# EAGLE design 230_color (EAGLE 9.6.2)
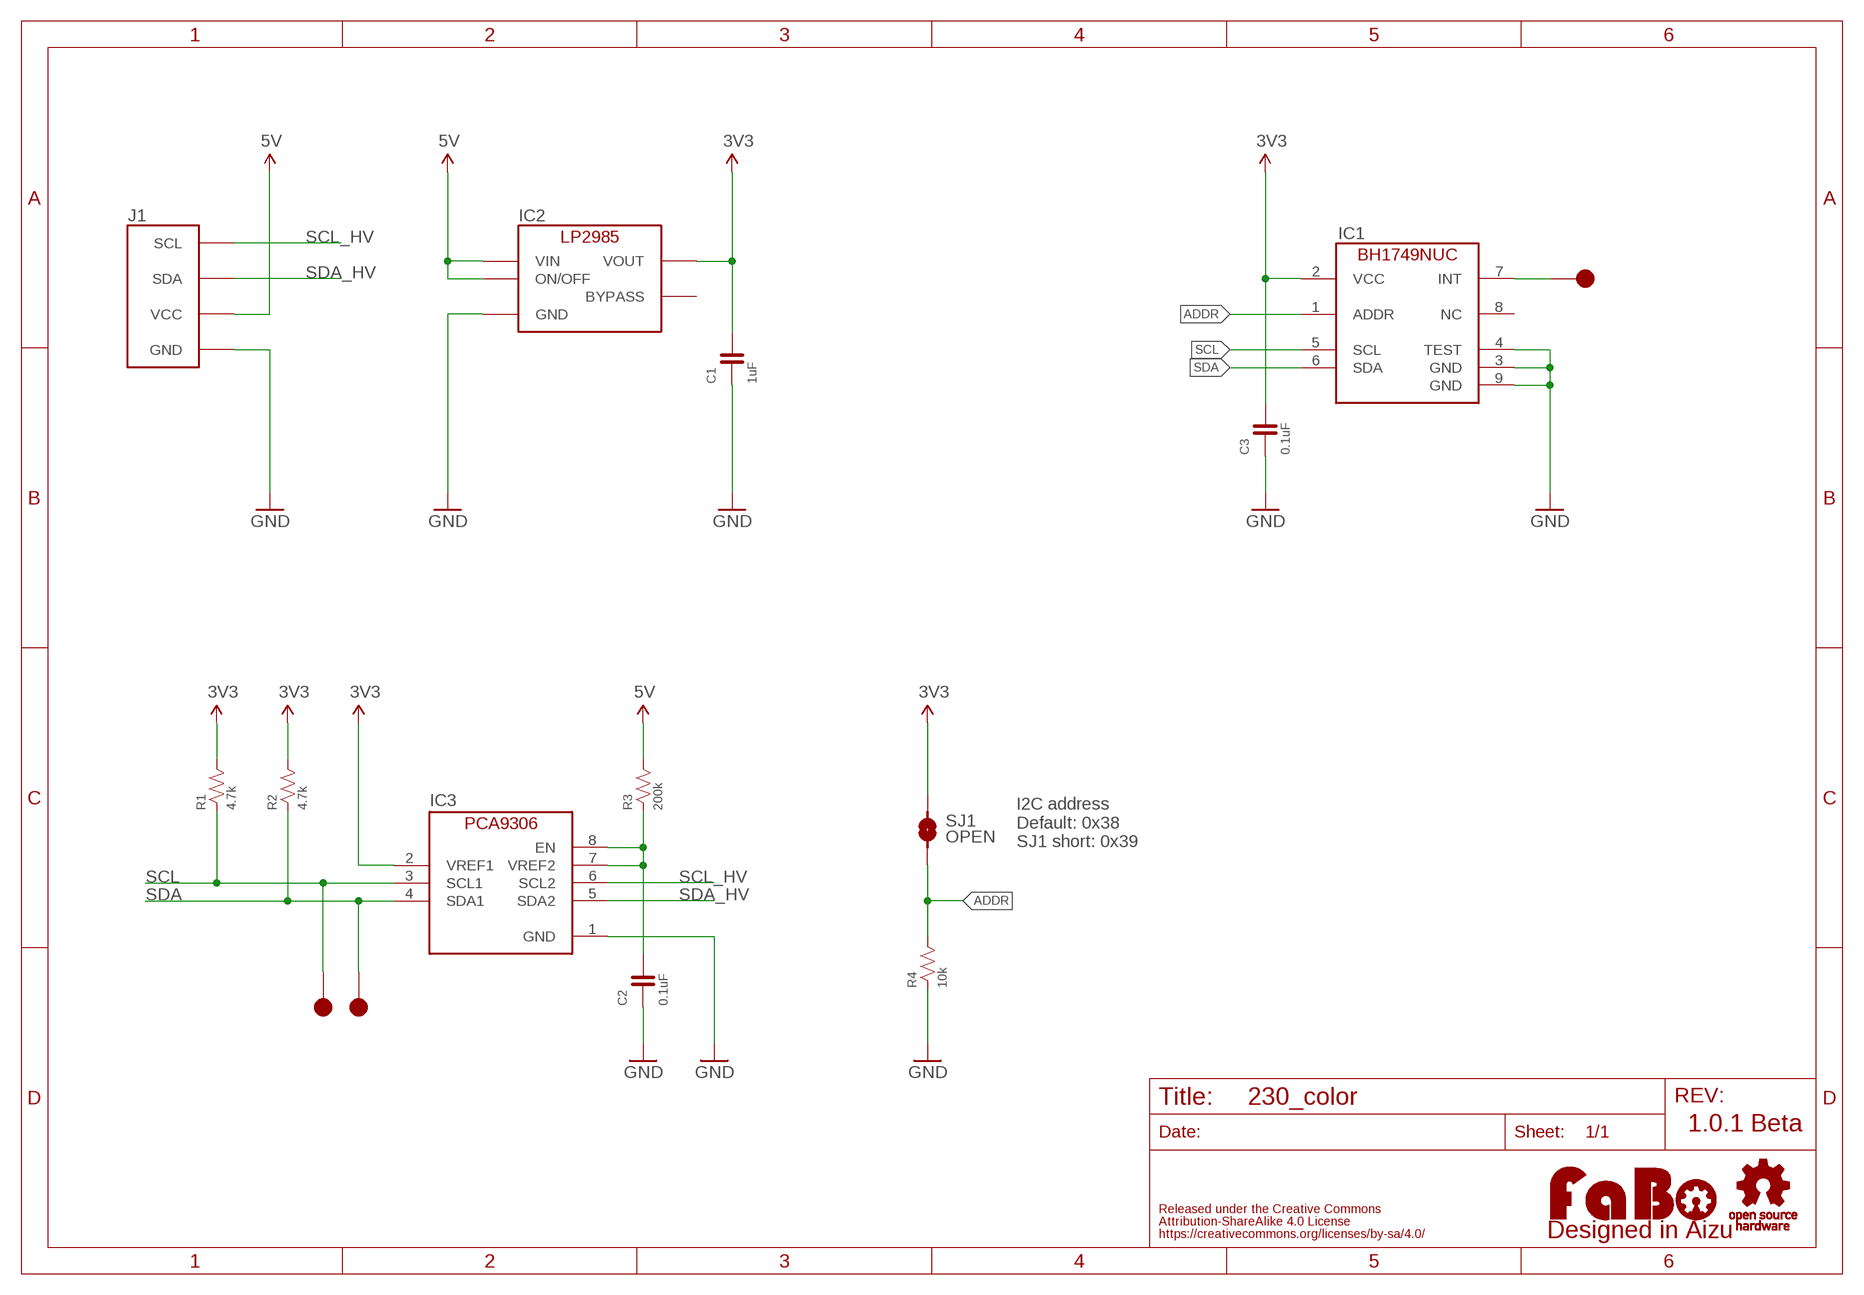
[diagram p0: schematic, sheet 1]

## Parts
C1  1uF  CAPACITOR-0603  [EIA0603]
C2  0.1uF  CAPACITOR-0603  [EIA0603]
C3  0.1uF  CAPACITOR-0603  [EIA0603]
IC1  BH1749NUC  [WSON008X2120]
IC2  LP2985-33DBV  [SOT-23-5]
IC3  PCA9306GM  [XQFN8]
J1  FABO_BRICK_I2C  [FABO_BRICK_I2C]
LOGO1  LOGO_FABO-M  [LOGO_FABO_M]
R1  4.7k  RESISTOR-0603  [EIA0603]
R2  4.7k  RESISTOR-0603  [EIA0603]
R3  200k  RESISTOR-0603  [EIA0603]
R4  10k  RESISTOR-0603  [EIA0603]
SJ1  OPEN  SMD-JUMPER-2  [SMD-JUMPER-2]
TP1  TP-15  [TP-15]
TP2  TP-15  [TP-15]
TP3  TP-15  [TP-15]
U$2  LOGO_OSHW-M_BOTTOM  [LOGO_OSHW_M_BOTTOM]

## Nets
3V3: C1.2 C3.2 IC1.2(VCC) IC2.5(VOUT) IC3.2(VREF1) R1.2 R2.2 SJ1.1
5V: IC2.1(VIN) IC2.3(ON/OFF) J1.VCC R3.2
ADDR: IC1.1(ADDR) R4.2 SJ1.2
GND: C1.1 C2.1 C3.1 IC1.3(GND) IC1.4(TEST) IC1.9(GND) IC2.2(GND) IC3.1(GND) J1.GND R4.1
INT: IC1.7(INT) TP3.1
N$1: C2.2 IC3.7(VREF2) IC3.8(EN) R3.1
SCL: IC1.5(SCL) IC3.3(SCL1) R1.1 TP2.1
SCL_HV: IC3.6(SCL2) J1.SCL
SDA: IC1.6(SDA) IC3.4(SDA1) R2.1 TP1.1
SDA_HV: IC3.5(SDA2) J1.SDA
Unconnected: IC1.8(NC) IC2.4(BYPASS)

## Notes on the sheet
- I2C address
  Default: 0x38
  SJ1 short: 0x39
- 1.0.1 Beta

## Library data of the parts
C1-C3 = component:CAPACITOR
IC1 = component:BH1749NUC
IC2 = FaBo-Supply:LP2985: LP2985
IC3 = FaBo-LevelTranslator:PCA9306
J1 = FaBo-Template:FABO_BRICK_I2C: FaBo Brick I2C
LOGO1 = component:LOGO_FABO
R1-R4 = component:RESISTOR
SJ1 = FaBo-etc:SMD-JUMPER-2
TP1 TP2 = FaBo-Supply:TP
TP3 = component:TP
U$2 = FaBo-etc:LOGO_OSHW

## Board
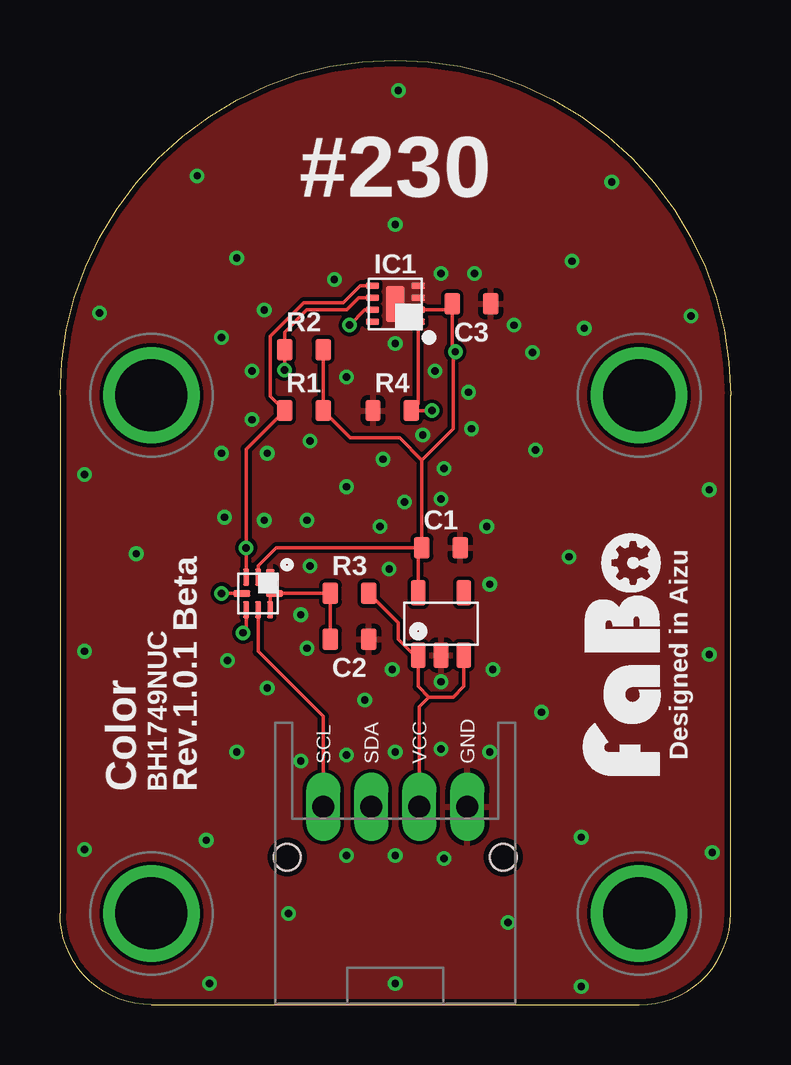
[diagram p1: board, top side]
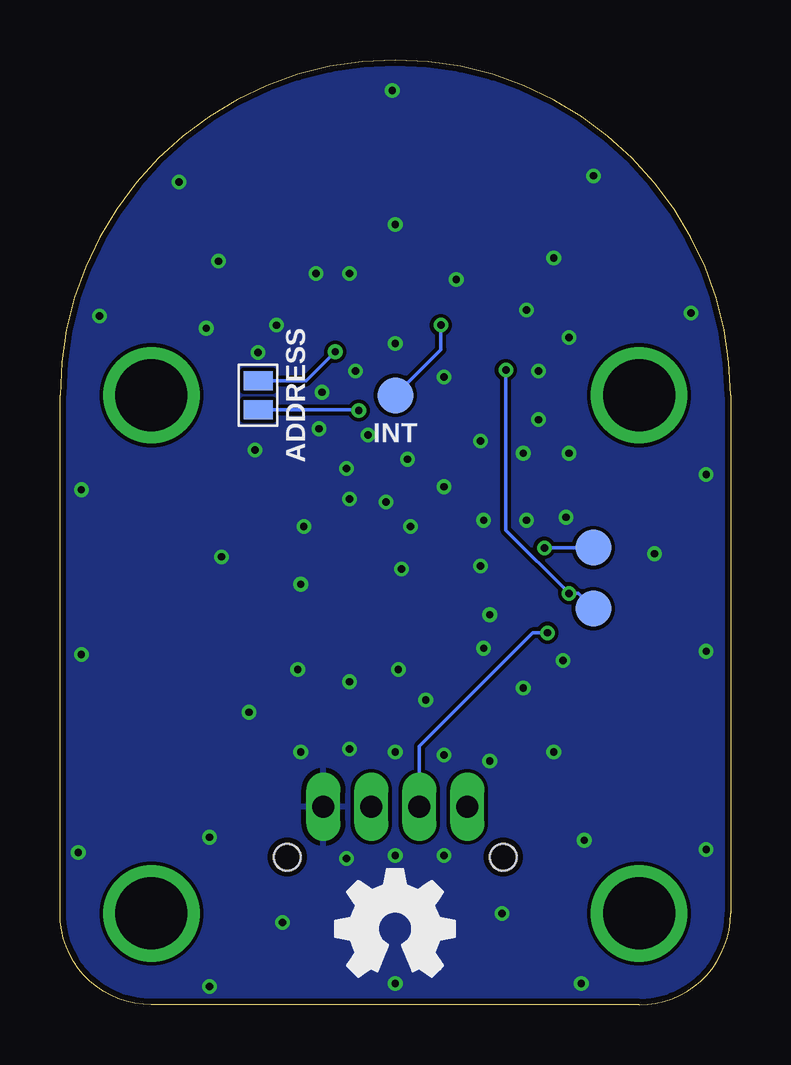
[diagram p2: board, bottom side, seen from below]

Size 27.94 x 39.37 mm. Coordinates in mm from the lower left corner, seen from the top.
Copper layers (1*16): Top 0.035mm / dielectric 1.6mm / Bottom 0.035mm
Design rules "PCBway": minimum track width 6mil, minimum drill 12mil, track to track 6mil, track to pad 6mil, pad to pad 6mil, via to via 6mil, smd to smd 6mil, copper to edge 10mil, drill to drill 10mil, minimum pad ring 10mil, minimum via ring 6mil, stop-mask expansion 2mil, vias tented up to drill 100mil, thermal gap 8mil

### Footprints (pad centres in the part's own frame; a part is rotated, then mirrored left to right if it is on the bottom)
EIA0603 = smd 0.65 x 0.9: 1 -0.8,0; 2 0.8,0
WSON008X2120 = smd 0.25 x 0.55: 1 -0.75,-0.95; 2 -0.25,-0.95; 3 0.25,-0.95; 4 0.75,-0.95; 5 0.75,0.95; 6 0.25,0.95; 7 -0.25,0.95; 8 -0.75,0.95 | smd 1.5 x 0.75: 9 0,0
SOT-23-5 = smd 0.6 x 1.05: 1 -0.95,-1.3; 2 0,-1.3; 3 0.95,-1.3; 4 0.95,1.3; 5 -0.95,1.3
XQFN8 = smd 0.7 x 0.35: 1 -0.675,0.5 | smd 0.7 x 0.25: 2 -0.675,0; 3 -0.675,-0.5; 5 0.675,-0.5; 6 0.675,0; 7 0.675,0.5 | smd 0.25 x 0.7: 4 0,-0.675; 8 0,0.675
FABO_BRICK_I2C = drill 0.9 pad 1.422 long: GND 3,-10.795; SCL -3,-10.795; SDA -1,-10.795; VCC 1,-10.795 | drill 3 pad 3.81: P$1 -10.16,6.35; P$2 10.16,6.35; P$3 -10.16,-15.24; P$4 10.16,-15.24 | hole 1.1: -4.5,-12.895; 4.5,-12.895
SMD-JUMPER-2 = smd 0.8 x 1.2: 1 -0.6,0; 2 0.6,0
TP-15 = smd 1.5 x 1.5: 1 0,0

### Placement (x,y rotation side)
C1  15.88,19.05 180 top
C2  12.06,15.24 180 top
C3  17.14,29.21 180 top
IC1  13.97,29.21 90 top
IC2  15.88,15.88 0 top
IC3  8.26,17.14 270 top
J1  13.97,19.05 0 top
LOGO1  25.4,14.61 90 top
R1  10.16,24.77 0 top
R2  10.16,27.3 0 top
R3  12.06,17.14 0 top
R4  13.84,24.77 0 top
SJ1  19.68,25.4 270 bottom
TP1  5.71,16.51 0 bottom
TP2  5.71,19.05 0 bottom
TP3  13.97,25.4 0 bottom
U$2  13.97,3.17 0 top

### Tracks (layer width: path | path; a pad name or v marks a point on that pad's centre or on a via)
3V3  (via drill 0.3)
  Top 0.152: 15.07,22.7 C1.2 | R2.2 R1.2 12.1,23.62 14.15,23.62 15.07,22.7 | IC2.5 14.93,18.9 C1.2 | IC3.2 8.26,18.29 9.02,19.05 C1.2 | IC1.2 16.09,28.96 C3.2 16.34,27.34 v16.47,27.22 16.38,27.13 16.38,24 15.07,22.7
  Bottom 0.152: SJ1.1 17.69,26 v16.47,27.22
5V
  Top 0.152: R3.2 14.1,15.91 14.1,15.24 14.76,14.57 IC2.1 14.93,13.27 15.37,12.83 | IC2.3 16.82,13.27 16.38,12.83 15.37,12.83 | J1.VCC 14.97,12.43 15.37,12.83
ADDR  (via drill 0.3)
  Top 0.152: v15.49,24.77 R4.2 14.92,25.04 IC1.1
  Bottom 0.152: SJ1.2 15.53,24.8 v15.49,24.77
GND  (via drill 0.3)
  other vias: 15.62,26.42 13.97,27.56 11.94,26.16 10.41,23.5 13.46,22.73 15.11,23.75 17.02,25.53 17.14,24 16,22.35 14.35,20.95 15.88,21.08 8.64,22.99 8,24.38 8,26.42 8.51,28.96 11.43,30.23 15.88,30.48 17.27,30.48 18.92,28.32 19.68,27.18 19.81,23.11 8.51,20.19 6.86,20.32 10.29,20.19 6.73,22.99 11.94,21.59 13.34,19.94 13.72,18.16 17.78,19.94 17.91,17.53 10.41,18.29 10.03,16.26 10.29,14.86 8.64,13.21 6.99,14.35 13.84,13.97 12.7,12.7 11.94,10.41 13.97,10.54 15.88,10.67 18.03,13.97 15.88,13.46 17.91,10.54 10.03,10.16 11.94,6.22 13.97,6.22 16,6.1 13.97,32.51 14.1,38.1 26.29,28.7 1.65,28.83 5.71,34.54 22.99,34.29 21.34,30.99 7.37,31.11 1.02,22.1 27.05,21.46 21.84,28.19 6.73,27.81 27.05,14.61 1.02,14.73 3.17,18.8 21.21,18.67 27.18,6.35 1.02,6.48 6.22,0.89 21.72,0.76 21.72,6.99 6.1,6.86 13.97,0.89 18.67,3.43 9.53,3.81 7.37,10.54 20.07,12.19
  pour Top (isolate 0.152, rank 3): 0,0 27.94,0 27.94,39.37 0,39.37
  pour Bottom (isolate 0.152, rank 3): 0,0 27.94,0 27.94,39.37 0,39.37
  pour Top (isolate 0.152, no thermals): 12.06,31.11 15.88,31.11 15.88,27.3 12.06,27.3
INT  (via drill 0.3)
  Top 0.152: IC1.7 12.7,28.96 v12.07,28.32
  Bottom 0.152: TP3.1 12.07,27.3 v12.07,28.32
N$1
  Top 0.152: IC3.7 8.76,17.14 IC3.8 R3.1 C2.2
SCL  (via drill 0.3)
  Top 0.152: IC3.3 v7.75,19.04 7.75,23.16 R1.1 8.76,25.36 8.76,27.86 10.16,29.26 11.81,29.26 12.51,29.96 IC1.5
  Bottom 0.152: TP2.1 v7.75,19.05 v7.75,19.04
SCL_HV
  Top 0.152: IC3.6 8.26,14.73 10.97,12.02 J1.SCL
SDA  (via drill 0.3)
  Top 0.152: IC1.6 12.44,29.46 11.94,28.96 10.29,28.96 9.36,28.03 R2.1 v9.36,26.45 | IC3.4 v6.73,17.14
  Bottom 0.152: TP1.1 6.35,17.14 v6.73,17.14 9.36,19.77 v9.36,26.45
SDA_HV  (via drill 0.3)
  Top 0.152: IC3.5 7.75,15.63 v7.63,15.5
  Bottom 0.152: v7.63,15.5 8.25,15.5 12.97,10.78 J1.SDA

### Text on the board
tPlace: #230 | Designed in Aizu | Color | BH1749NUC | Rev.1.0.1 Beta
bPlace: ADDRESS | INT